# Altium schematic sheet LOOP_LEDS.SchDoc
size A4
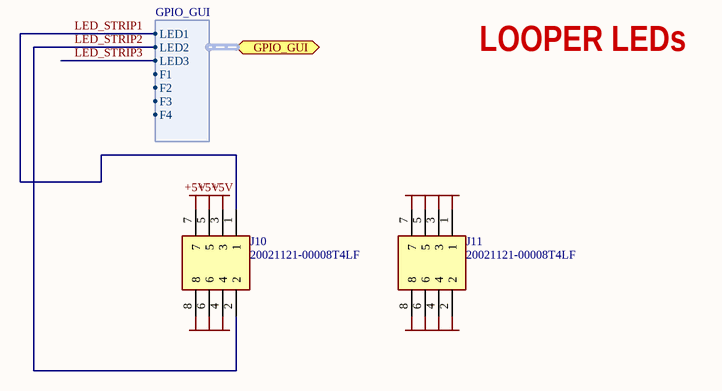
[diagram p0: LOOP_LEDS.SchDoc]

## Parts
J10  20021121-00008T4LF  [2002112100008T4LF]
J11  20021121-00008T4LF  [2002112100008T4LF]

## Ports
GPIO_GUI (bidir, harness GPIO_GUI)

## Harnesses
GPIO_GUI: LED1, LED2, F1, F2, F3, F4, LED3

## Nets
+5V: J10.3 J10.5 J10.7
GND: J10.4 J10.6 J10.8 J11.1 J11.2 J11.3 J11.4 J11.5 J11.6 J11.7 J11.8
LED_STRIP1: J10.1 ; port GPIO_GUI.LED1
LED_STRIP2: J10.2 ; port GPIO_GUI.LED2
LED_STRIP3: port GPIO_GUI.LED3

## Notes on the sheet
- LOOPER LEDs

## Library data of the parts
J10 J11 = 20021121-00008T4LF: Connector; Manufacturer_Name: Amphenol Communications Solutions; Datasheet Link: https://cdn.amphenol-cs.com/media/wysiwyg/files/drawing/20021121.pdf; Height: 4.55mm; Manufacturer_Part_Number: 20021121-00008T4LF
  J10: System: Connector